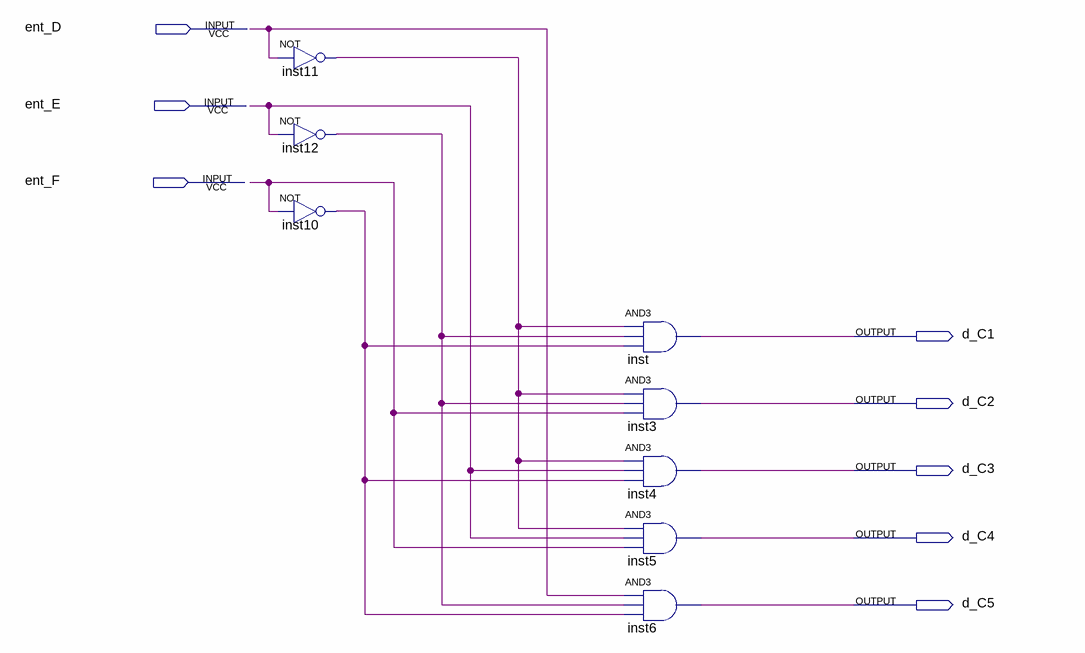
[diagram p0: schematic sheet]
// Quartus schematic Decodificador_Colunas.bdf as structural Verilog: 8 symbols, 8 pins
module Decodificador_Colunas (
  input  ent_D,
  input  ent_E,
  input  ent_F,
  output d_C1,
  output d_C2,
  output d_C3,
  output d_C4,
  output d_C5
);

  wire inst10_out, inst11_out, inst12_out;

  not inst11 (inst11_out, ent_D);
  not inst12 (inst12_out, ent_E);
  not inst10 (inst10_out, ent_F);
  and inst (d_C1, inst11_out, inst12_out, inst10_out);
  and inst3 (d_C2, inst11_out, inst12_out, ent_F);
  and inst4 (d_C3, inst11_out, ent_E, inst10_out);
  and inst5 (d_C4, inst11_out, ent_E, ent_F);
  and inst6 (d_C5, ent_D, inst12_out, inst10_out);
endmodule
